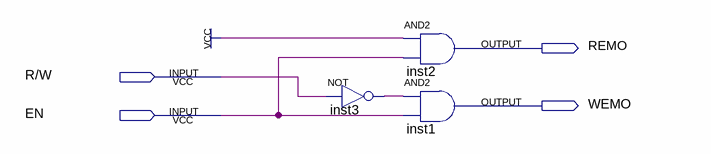
[diagram p0: schematic sheet]
// Quartus schematic IOControl.bdf as structural Verilog: 3 symbols, 4 pins
module IOControl (
  input  \R/W ,
  input  EN,
  output REMO,
  output WEMO
);

  wire inst3_out;

  not inst3 (inst3_out, \R/W );
  and inst2 (REMO, 1'b1, EN);
  and inst1 (WEMO, inst3_out, EN);
endmodule
